# Altium schematic sheet Top.SchDoc
size A4; SheetNumber: 1; SheetTotal: 7; NameOfSheet: Top sheet
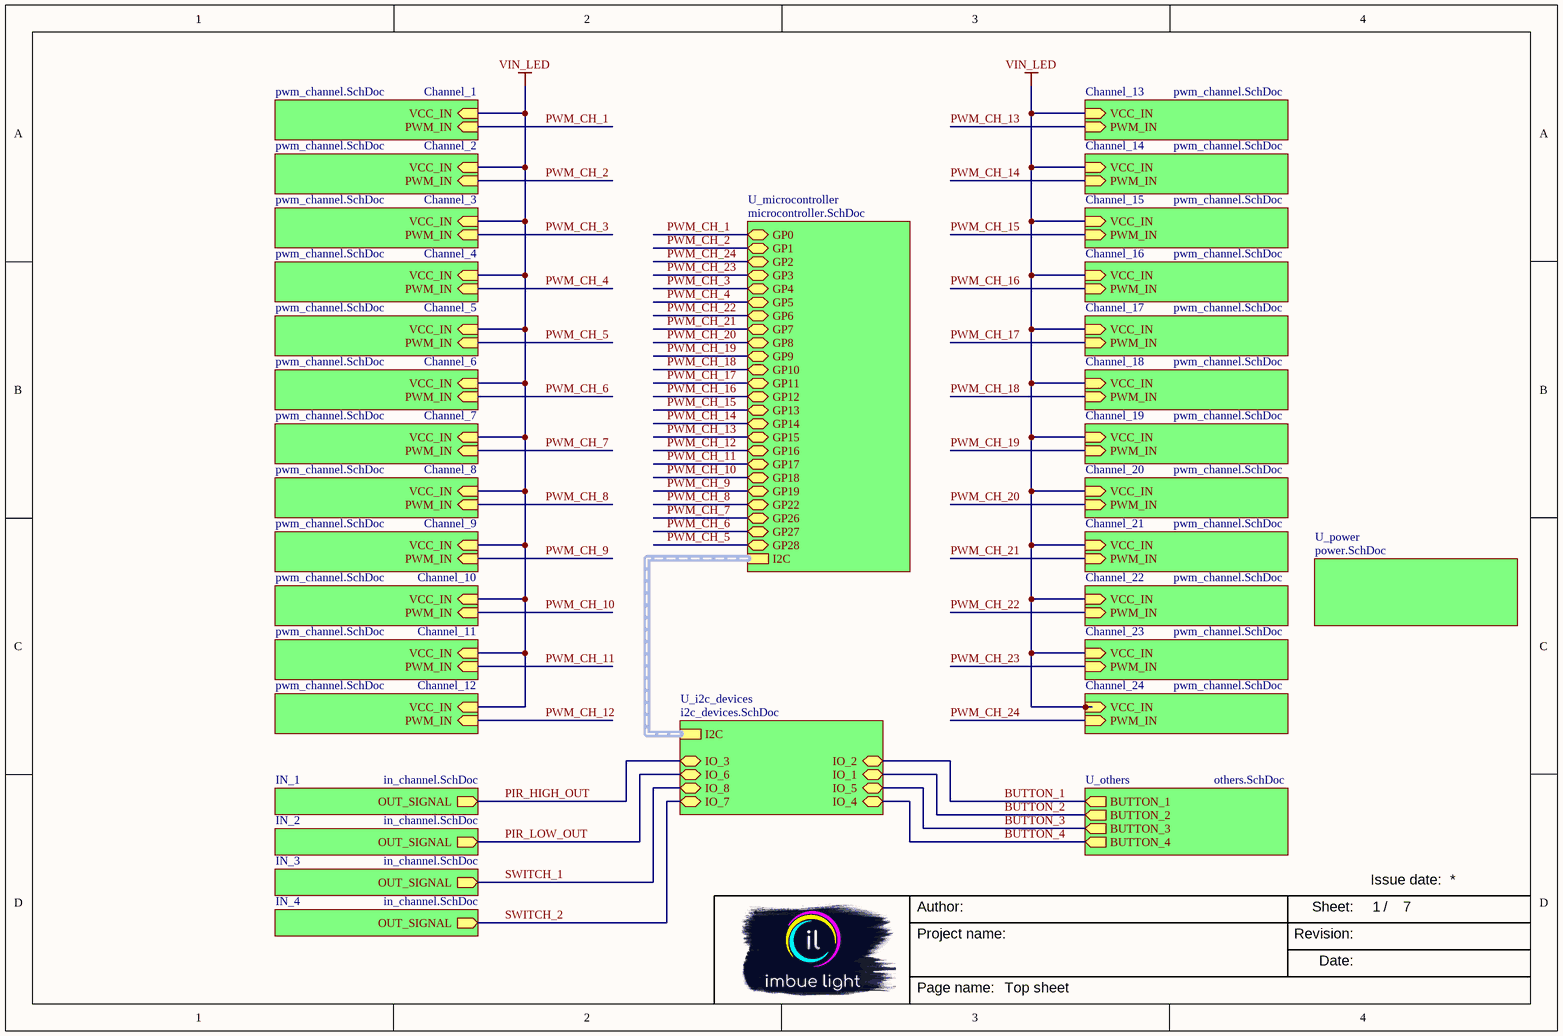
[diagram p0: Top.SchDoc]

## Sub-sheets
Channel_1 = pwm_channel.SchDoc: VCC_IN (in), PWM_IN (in)
Channel_2 = pwm_channel.SchDoc: VCC_IN (in), PWM_IN (in)
Channel_3 = pwm_channel.SchDoc: VCC_IN (in), PWM_IN (in)
Channel_4 = pwm_channel.SchDoc: VCC_IN (in), PWM_IN (in)
Channel_5 = pwm_channel.SchDoc: VCC_IN (in), PWM_IN (in)
Channel_6 = pwm_channel.SchDoc: VCC_IN (in), PWM_IN (in)
Channel_7 = pwm_channel.SchDoc: VCC_IN (in), PWM_IN (in)
Channel_8 = pwm_channel.SchDoc: VCC_IN (in), PWM_IN (in)
Channel_9 = pwm_channel.SchDoc: VCC_IN (in), PWM_IN (in)
Channel_10 = pwm_channel.SchDoc: VCC_IN (in), PWM_IN (in)
Channel_11 = pwm_channel.SchDoc: VCC_IN (in), PWM_IN (in)
Channel_12 = pwm_channel.SchDoc: VCC_IN (in), PWM_IN (in)
Channel_13 = pwm_channel.SchDoc: VCC_IN (in), PWM_IN (in)
Channel_14 = pwm_channel.SchDoc: VCC_IN (in), PWM_IN (in)
Channel_15 = pwm_channel.SchDoc: VCC_IN (in), PWM_IN (in)
Channel_16 = pwm_channel.SchDoc: VCC_IN (in), PWM_IN (in)
Channel_17 = pwm_channel.SchDoc: VCC_IN (in), PWM_IN (in)
Channel_18 = pwm_channel.SchDoc: VCC_IN (in), PWM_IN (in)
Channel_19 = pwm_channel.SchDoc: VCC_IN (in), PWM_IN (in)
Channel_20 = pwm_channel.SchDoc: VCC_IN (in), PWM_IN (in)
Channel_21 = pwm_channel.SchDoc: VCC_IN (in), PWM_IN (in)
Channel_22 = pwm_channel.SchDoc: VCC_IN (in), PWM_IN (in)
Channel_23 = pwm_channel.SchDoc: VCC_IN (in), PWM_IN (in)
Channel_24 = pwm_channel.SchDoc: VCC_IN (in), PWM_IN (in)
IN_1 = in_channel.SchDoc: OUT_SIGNAL (out)
IN_2 = in_channel.SchDoc: OUT_SIGNAL (out)
IN_3 = in_channel.SchDoc: OUT_SIGNAL (out)
IN_4 = in_channel.SchDoc: OUT_SIGNAL (out)
U_i2c_devices = i2c_devices.SchDoc: I2C (harness I2C_SYS2), IO_1 (bidir), IO_2 (bidir), IO_3 (bidir), IO_4 (bidir), IO_5 (bidir), IO_6 (bidir), IO_7 (bidir), IO_8 (bidir)
U_microcontroller = microcontroller.SchDoc: GP0 (bidir), GP1 (bidir), GP2 (bidir), GP3 (bidir), GP4 (bidir), GP5 (bidir), GP6 (bidir), GP7 (bidir), GP8 (bidir), GP9 (bidir), GP10 (bidir), GP11 (bidir), GP12 (bidir), GP13 (bidir), GP14 (bidir), GP15 (bidir), GP16 (bidir), GP17 (bidir), GP18 (bidir), GP19 (bidir), GP22 (bidir), GP26 (bidir), GP27 (bidir), GP28 (bidir), I2C (harness I2C_SYS2)
U_others = others.SchDoc: BUTTON_1 (out), BUTTON_2 (out), BUTTON_3 (out), BUTTON_4 (out)
U_power = power.SchDoc: no entries

## Nets
VIN_LED: sheet Channel_1/VCC_IN, sheet Channel_2/VCC_IN, sheet Channel_3/VCC_IN, sheet Channel_4/VCC_IN, sheet Channel_5/VCC_IN, sheet Channel_6/VCC_IN, sheet Channel_7/VCC_IN, sheet Channel_8/VCC_IN, sheet Channel_9/VCC_IN, sheet Channel_10/VCC_IN, sheet Channel_11/VCC_IN, sheet Channel_12/VCC_IN, sheet Channel_13/VCC_IN, sheet Channel_14/VCC_IN, sheet Channel_15/VCC_IN, sheet Channel_16/VCC_IN, sheet Channel_17/VCC_IN, sheet Channel_18/VCC_IN, sheet Channel_19/VCC_IN, sheet Channel_20/VCC_IN, sheet Channel_21/VCC_IN, sheet Channel_22/VCC_IN, sheet Channel_23/VCC_IN, sheet Channel_24/VCC_IN
BUTTON_1: sheet U_i2c_devices/IO_2, sheet U_others/BUTTON_1
BUTTON_2: sheet U_i2c_devices/IO_1, sheet U_others/BUTTON_2
BUTTON_3: sheet U_i2c_devices/IO_5, sheet U_others/BUTTON_3
BUTTON_4: sheet U_i2c_devices/IO_4, sheet U_others/BUTTON_4
PIR_HIGH_OUT: sheet IN_1/OUT_SIGNAL, sheet U_i2c_devices/IO_3
PIR_LOW_OUT: sheet IN_2/OUT_SIGNAL, sheet U_i2c_devices/IO_6
PWM_CH_1: sheet Channel_1/PWM_IN, sheet U_microcontroller/GP0
PWM_CH_2: sheet Channel_2/PWM_IN, sheet U_microcontroller/GP1
PWM_CH_3: sheet Channel_3/PWM_IN, sheet U_microcontroller/GP4
PWM_CH_4: sheet Channel_4/PWM_IN, sheet U_microcontroller/GP5
PWM_CH_5: sheet Channel_5/PWM_IN, sheet U_microcontroller/GP28
PWM_CH_6: sheet Channel_6/PWM_IN, sheet U_microcontroller/GP27
PWM_CH_7: sheet Channel_7/PWM_IN, sheet U_microcontroller/GP26
PWM_CH_8: sheet Channel_8/PWM_IN, sheet U_microcontroller/GP22
PWM_CH_9: sheet Channel_9/PWM_IN, sheet U_microcontroller/GP19
PWM_CH_10: sheet Channel_10/PWM_IN, sheet U_microcontroller/GP18
PWM_CH_11: sheet Channel_11/PWM_IN, sheet U_microcontroller/GP17
PWM_CH_12: sheet Channel_12/PWM_IN, sheet U_microcontroller/GP16
PWM_CH_13: sheet Channel_13/PWM_IN, sheet U_microcontroller/GP15
PWM_CH_14: sheet Channel_14/PWM_IN, sheet U_microcontroller/GP14
PWM_CH_15: sheet Channel_15/PWM_IN, sheet U_microcontroller/GP13
PWM_CH_16: sheet Channel_16/PWM_IN, sheet U_microcontroller/GP12
PWM_CH_17: sheet Channel_17/PWM_IN, sheet U_microcontroller/GP11
PWM_CH_18: sheet Channel_18/PWM_IN, sheet U_microcontroller/GP10
PWM_CH_19: sheet Channel_19/PWM_IN, sheet U_microcontroller/GP9
PWM_CH_20: sheet Channel_20/PWM_IN, sheet U_microcontroller/GP8
PWM_CH_21: sheet Channel_21/PWM_IN, sheet U_microcontroller/GP7
PWM_CH_22: sheet Channel_22/PWM_IN, sheet U_microcontroller/GP6
PWM_CH_23: sheet Channel_23/PWM_IN, sheet U_microcontroller/GP3
PWM_CH_24: sheet Channel_24/PWM_IN, sheet U_microcontroller/GP2
SWITCH_1: sheet IN_3/OUT_SIGNAL, sheet U_i2c_devices/IO_8
SWITCH_2: sheet IN_4/OUT_SIGNAL, sheet U_i2c_devices/IO_7

## Buses and harness runs
harness sheet U_i2c_devices/I2C = sheet U_microcontroller/I2C

## Notes on the sheet
- Author:
- Sheet:
- /
- Issue date:
- Project name:
- Revision:
- Date:
- Page name: